# EAGLE design lcmeter (EAGLE 7.6.0)
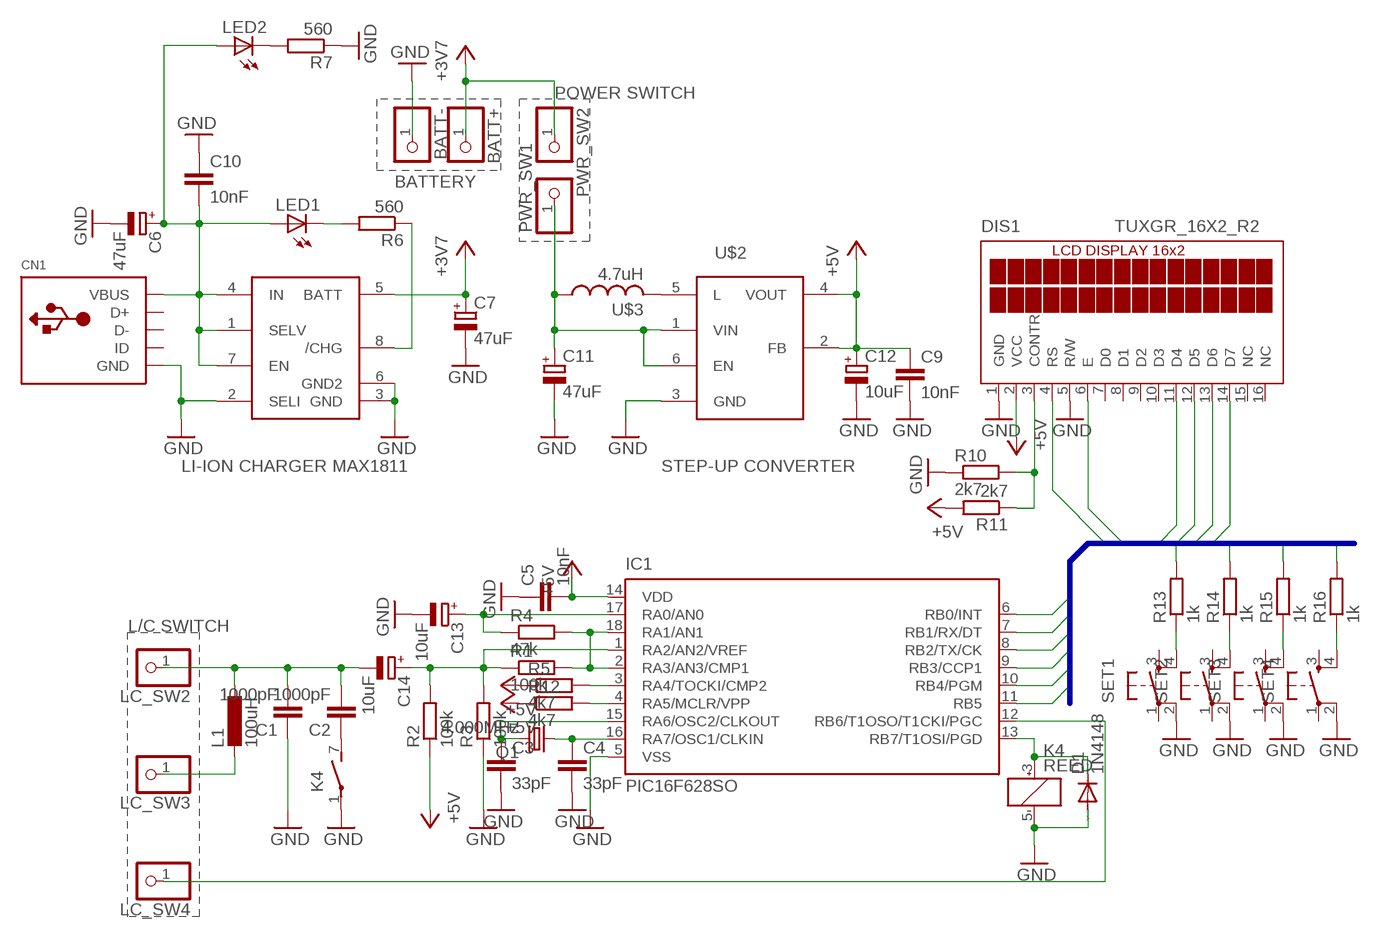
[diagram p0: schematic, sheet 1]

## Parts
BATT+  PINHD-1X1  [1X01]
BATT-  PINHD-1X1  [1X01]
C1  1000pF  C-EUC0805  [C0805]
C2  1000pF  C-EUC0805  [C0805]
C3  33pF  C-EUC0805  [C0805]
C4  33pF  C-EUC0805  [C0805]
C5  10nF  C-EUC0805  [C0805]
C6  47uF  CPOL-EUB/3528-21W  [B/3528-21W]
C7  47uF  CPOL-EUB/3528-21W  [B/3528-21W]
C9  10nF  C-EUC0805  [C0805]
C10  10nF  C-EUC0805  [C0805]
C11  47uF  CPOL-EUB/3528-21W  [B/3528-21W]
C12  10uF  CPOL-EUB/3528-21W  [B/3528-21W]
C13  10uF  CPOL-EUB/3528-21W  [B/3528-21W]
C14  10uF  CPOL-EUB/3528-21W  [B/3528-21W]
CN1  USBMINIB  [USB-MINIB]
D1  1N4148  DIODE-MINIMELF  [MINIMELF]
DIS1  TUXGR_16X2_R2  [TUXGR_16X2_R2]
IC1  PIC16F628SO  [SO-18W]
K4  REED  [REED]
L1  100uH  L-EU0204/5  [0204/5]
LC_SW2  PINHD-1X1  [1X01]
LC_SW3  PINHD-1X1  [1X01]
LC_SW4  PINHD-1X1  [1X01]
LED1  LED1206  [LED-1206]
LED2  LED1206  [LED-1206]
PWR_SW1  PINHD-1X1  [1X01]
PWR_SW2  PINHD-1X1  [1X01]
Q1  4.000MHz  CRYSTAL_CRYTALSM49  [CRYSTAL_SM49]
R1  100k  R-EU_R0603  [R0603]
R2  100k  R-EU_R0603  [R0603]
R3  100k  R-EU_R0603  [R0603]
R4  47k  R-EU_R0603  [R0603]
R5  4k7  R-EU_R0603  [R0603]
R6  560  R-EU_R0603  [R0603]
R7  560  R-EU_R0603  [R0603]
R10  2k7  R-EU_R0603  [R0603]
R11  2k7  R-EU_R0603  [R0603]
R12  4k7  R-EU_R0603  [R0603]
R13  1k  R-EU_R0603  [R0603]
R14  1k  R-EU_R0603  [R0603]
R15  1k  R-EU_R0603  [R0603]
R16  1k  R-EU_R0603  [R0603]
SET1  TAC_SWITCHPTH  [TACTILE-PTH]
SET2  TAC_SWITCHPTH  [TACTILE-PTH]
SET3  TAC_SWITCHPTH  [TACTILE-PTH]
SET4  TAC_SWITCHPTH  [TACTILE-PTH]
U$1  MAX1811SO8  [SO08]
U$2  TPS6122XSOT-6  [SOT23-6]
U$3  4.7uH  EPL3015-OK  [EPL3015]

## Nets
+3V3: BATT+.1 C7.+ PWR_SW2.1 U$1.5(BATT) ; supply symbol labelled +3V7
+5V: C5.2 C9.1 C12.+ DIS1.2(VCC) IC1.14(VDD) R2.1 R5.1 R11.2 R12.1 U$2.2(FB) U$2.4(VOUT)
GND: BATT-.1 C1.1 C3.2 C4.2 C5.1 C6.- C7.- C9.2 C10.1 C11.- C12.- C13.- CN1.GND D1.A DIS1.1(GND) DIS1.5(R/W) IC1.5(VSS) K4.1(2:P) K4.5(1:-) R3.1 R7.1 R10.1 SET1.2 SET2.2 SET3.2 SET4.2 U$1.2(SELI) U$1.3(GND) U$1.6(GND2) U$2.3(GND)
LCDPIN0: DIS1.4(RS) IC1.6(RB0/INT)
LCDPIN1: DIS1.6(E) IC1.7(RB1/RX/DT)
LCDPIN2: DIS1.11(D4) IC1.8(RB2/TX/CK) R13.2
LCDPIN3: DIS1.12(D5) IC1.9(RB3/CCP1) R14.2
LCDPIN4: DIS1.13(D6) IC1.11(RB5) R15.2
LCDPIN5: DIS1.14(D7) IC1.10(RB4/PGM) R16.2
N$1: C13.+ IC1.17(RA0/AN0) R4.1
N$2: IC1.2(RA3/AN3/CMP1) IC1.18(RA1/AN1) R1.2 R4.2
N$3: C14.+ IC1.1(RA2/AN2/VREF) R1.1 R2.2 R3.2
N$4: C1.2 C2.2 C14.- L1.1 LC_SW2.1
N$5: DIS1.3(CONTR) R10.2 R11.1
N$6: C2.1 K4.7(2:S)
N$7: IC1.3(RA4/TOCKI/CMP2) R5.2
N$8: IC1.12(RB6/T1OSO/T1CKI/PGC) LC_SW4.1
N$9: C4.1 IC1.16(RA7/OSC1/CLKIN) Q1.1
N$10: C3.1 IC1.15(RA6/OSC2/CLKOUT) Q1.2
N$11: D1.C IC1.13(RB7/T1OSI/PGD) K4.3(1:+)
N$12: R13.1 SET1.4
N$13: R14.1 SET2.4
N$14: R15.1 SET3.4
N$15: R16.1 SET4.4
N$16: IC1.4(RA5/MCLR/VPP) R12.2
N$17: L1.2 LC_SW3.1
N$18: C6.+ C10.2 CN1.VBUS LED1.A LED2.A U$1.1(SELV) U$1.4(IN) U$1.7(EN)
N$19: U$2.5(L) U$3.P$2
N$20: LED1.C R6.2
N$21: R6.1 U$1.8(/CHG)
N$23: C11.+ PWR_SW1.1 U$2.1(VIN) U$2.6(EN) U$3.P$1
N$24: LED2.C R7.2
Unconnected: CN1.D+ CN1.D- CN1.ID DIS1.7(D0) DIS1.8(D1) DIS1.9(D2) DIS1.10(D3) DIS1.15(NC) DIS1.16(NC) SET1.1 SET1.3 SET2.1 SET2.3 SET3.1 SET3.3 SET4.1 SET4.3

## Buses
LCDPIN[0..5]

## Notes on the sheet
- POWER SWITCH
- BATTERY
- LI-ION CHARGER MAX1811 | STEP-UP CONVERTER
- L/C SWITCH

## Library data of the parts
BATT+ BATT- LC_SW2-LC_SW4 PWR_SW1 PWR_SW2 = adafruit:PINHD-1X1: Pin header 1x1 for 0.1" spacing With round pins
C1-C5 C9 C10 = rcl:C-EU: CAPACITOR, European symbol
C6 C7 C11-C14 = rcl:CPOL-EU: POLARIZED CAPACITOR, European symbol
CN1 = adafruit:USB: USB Connectors USBMINIB - Surface Mount Female Mini-B USB Connector 4UConnector: 06564 By microbuilder.eu Thru-hole RA Female Mini-B USB Connector 4UConnector: 18732 By ladyada.net
D1 = diode:DIODE-: DIODE
DIS1 = display-lcd:TUXGR_16X2_R2: Tuxgraphics LCD display 16x2 characters reflective, without background light Source: tuxgr_12x2_r2.pdf; OC_FARNELL: unknown; OC_NEWARK: unknown
IC1 = microchip:PIC16F62*: FLASH-Based 8-Bit CMOS Microcontroller Source: http://ww1.microchip.com/downloads/en/DeviceDoc/40300C.pdf; MF: MICROCHIP; MPN: PIC16F628-20I/SO; OC_FARNELL: 9760415; OC_NEWARK: 23C4986
K4 = relay:REED: RELAY reed, 1 x norm. open with polarity, grid 5.08; OC_FARNELL: unknown; OC_NEWARK: unknown
L1 = rcl:L-EU: INDUCTOR, European symbol
LED1 LED2 = SparkFun:LED: LEDs Standard schematic elements and footprints for 5mm, 3mm, 1206, and 0603 sized LEDs. 5mm - Spark Fun Electronics SKU : COM-00529 (and others)
Q1 = icetubes:CRYSTAL_CRYTAL: CRYSTAL
R1-R7 R10-R16 = rcl:R-EU_: RESISTOR, European symbol
SET1-SET4 = SparkFun:TAC_SWITCH: Momentary Switch Button commonly used for reset or general input. Spark Fun Electronics SKU : COM-00097
U$1 = adafruit:MAX1811: Maxim MAX1811 USB li-ion battery charger http://www.ladyada.net/library/eagle
U$2 = trax_540:TPS6122X: Texas Instruments TPS6122x Low Input Voltage Step-up Converter Reference: http://focus.ti.com/docs/prod/folders/print/tps61220.html
U$3 = trax_540:EPL3015

## Board
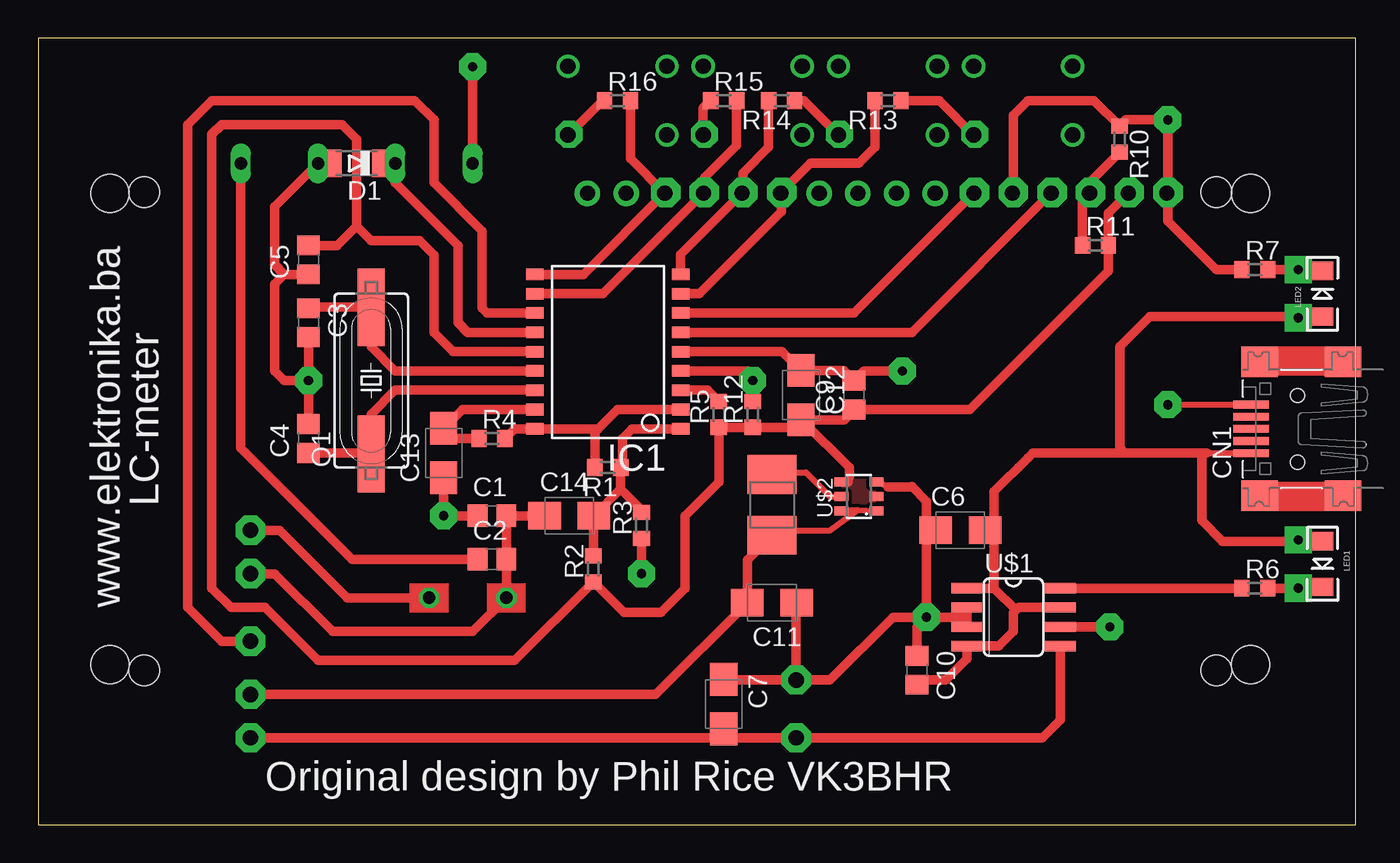
[diagram p1: board, top side]
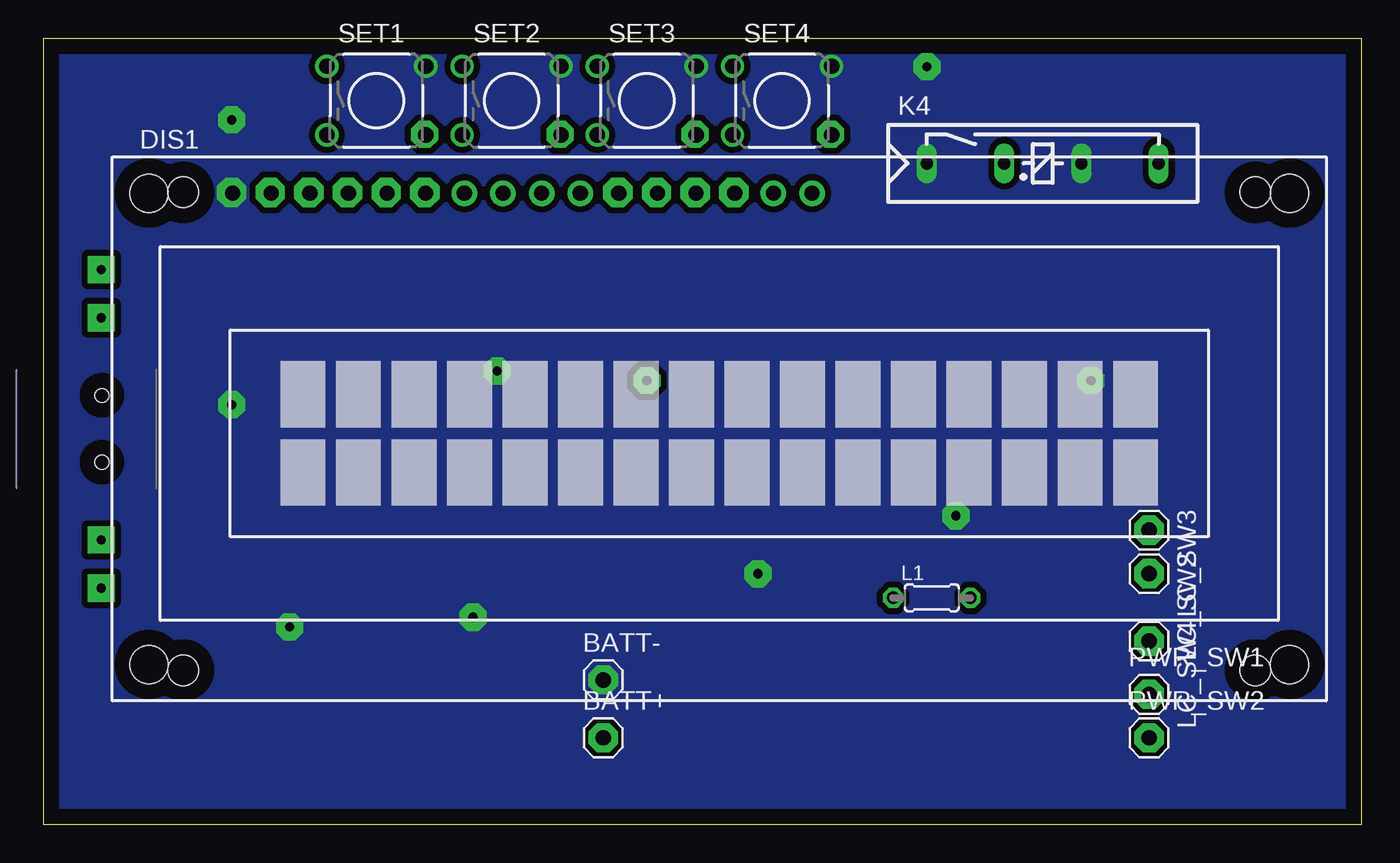
[diagram p2: board, bottom side, seen from below]

Size 86.66 x 51.74 mm. Coordinates in mm from the lower left corner, seen from the top.
Outline: 0,0 86.66,0 86.66,51.74 0,51.74 0,0
Copper layers (1*16): Top 0.035mm / dielectric 1.5mm / Bottom 0.035mm
Design rules "default": minimum track width 10mil, minimum drill 24mil, track to track 8mil, track to pad 8mil, pad to pad 8mil, via to via 8mil, smd to smd 8mil, copper to edge 40mil, drill to drill 8mil, minimum pad ring 10mil, minimum via ring 8mil, stop-mask expansion 4mil, vias tented up to drill 0mil, thermal gap 10mil
Holes 2 mm at 6.99,41.59 6.99,10.16 77.47,41.59 77.47,10.16

### Footprints (pad centres in the part's own frame; a part is rotated, then mirrored left to right if it is on the bottom)
1X01 = drill 1.016 pad 1.93 octagon: 1 0,0
C0805 = smd 1.3 x 1.5: 1 -0.95,0; 2 0.95,0
B/3528-21W = smd 2.15 x 1.8: + 1.625,0; - -1.625,0
USB-MINIB = smd 0.5 x 2.308: D+ 0,4.064; D- -0.8,4.064; GND 1.6,4.064; ID 0.8,4.064; VBUS -1.6,4.064 | smd 2 x 2.4: GND1 -4.4,-2; GND2 -4.4,3.5; GND3 4.4,3.5; GND4 4.4,-2 | hole 0.9: -2.2,1; 2.2,1
MINIMELF = smd 1.4 x 1.8: A 1.7,0; C -1.7,0
TUXGR_16X2_R2 = drill 1 pad 1.676: 1 -32,15.5; 2 -29.46,15.5; 3 -26.92,15.5; 4 -24.38,15.5; 5 -21.84,15.5; 6 -19.3,15.5; 7 -16.76,15.5; 8 -14.22,15.5; 9 -11.68,15.5; 10 -9.14,15.5; 11 -6.6,15.5; 12 -4.06,15.5; 13 -1.52,15.5; 14 1.02,15.5; 15 3.56,15.5; 16 6.1,15.5 | hole 2.5: -37.5,-15.5; 37.5,-15.5; -37.5,15.5; 37.5,15.5
SO-18W = smd 0.762 x 1.143: 1 -5.08,-4.788; 2 -3.81,-4.788; 3 -2.54,-4.788; 4 -1.27,-4.788; 5 0,-4.788; 6 1.27,-4.788; 7 2.54,-4.788; 8 3.81,-4.788; 9 5.08,-4.788; 10 5.08,4.788; 11 3.81,4.788; 12 2.54,4.788; 13 1.27,4.788; 14 0,4.788; 15 -1.27,4.788; 16 -2.54,4.788; 17 -3.81,4.788; 18 -5.08,4.788
REED = drill 0.813 long: 1 -17.78,2.54; 3 -12.7,2.54; 5 -7.62,2.54; 7 -2.54,2.54
0204/5 = drill 0.813 octagon: 1 -2.54,0; 2 2.54,0
LED-1206 = smd 1.2 x 1.4: A -1.5,0; C 1.5,0
CRYSTAL_SM49 = smd 5.08 x 1.778: 1 -4.826,0; 2 4.826,0
R0603 = smd 1 x 1.1: 1 -0.85,0; 2 0.85,0
TACTILE-PTH = drill 1.016: 1 -3.251,2.261; 2 3.251,2.261; 3 -3.251,-2.261; 4 3.251,-2.261
SO08 = smd 0.66 x 2.032: 1 -1.905,-3.073; 2 -0.635,-3.073; 3 0.635,-3.073; 4 1.905,-3.073; 5 1.905,3.073; 6 0.635,3.073; 7 -0.635,3.073; 8 -1.905,3.073
SOT23-6 = smd 0.6 x 0.9: 1 -0.95,-1.15; 2 0,-1.15; 3 0.95,-1.15; 4 0.95,1.15; 5 0,1.15; 6 -0.95,1.15
EPL3015 = smd 2.54 x 3.2: P$1 -0.953,0; P$2 3.035,0

### Placement (x,y rotation side)
BATT+  49.85,5.71 0 bottom
BATT-  49.85,9.53 0 bottom
C1  29.84,20.32 0 top
C2  29.84,17.46 0 top
C3  17.78,33.02 270 top
C4  17.78,25.4 90 top
C5  17.78,37.15 90 top
C6  60.64,19.37 0 top
C7  45.09,7.94 270 top
C9  53.66,28.26 90 top
C10  57.78,10.16 270 top
C11  48.26,14.61 180 top
C12  50.16,28.26 270 top
C13  26.67,24.45 90 top
C14  34.92,20.32 0 top
CN1  83.82,26.04 90 top
D1  20.95,43.5 180 top
DIS1  42.23,26.04 0 bottom
IC1  37.47,31.11 90 top
K4  10.79,40.96 0 bottom
L1  28.26,14.92 0 bottom
LC_SW2  13.97,16.51 270 bottom
LC_SW3  13.97,19.37 270 bottom
LC_SW4  13.97,12.06 270 bottom
LED1  84.45,17.14 270 top
LED2  84.45,34.92 90 top
PWR_SW1  13.97,8.57 0 bottom
PWR_SW2  13.97,5.71 0 bottom
Q1  21.91,29.21 90 top
R1  37.47,23.5 180 top
R2  36.51,16.83 90 top
R3  39.69,19.68 90 top
R4  29.84,25.4 0 top
R5  44.77,26.99 90 top
R6  80.01,15.56 0 top
R7  80.01,36.51 0 top
R10  71.12,45.09 270 top
R11  69.53,38.1 0 top
R12  46.99,26.99 90 top
R13  55.88,47.62 180 top
R14  48.9,47.62 180 top
R15  45.09,47.62 0 top
R16  38.1,47.62 0 top
SET1  64.77,47.62 0 bottom
SET2  55.88,47.62 0 bottom
SET3  46.99,47.62 0 bottom
SET4  38.1,47.62 0 bottom
U$1  64.14,13.65 270 top
U$2  53.98,21.59 90 top
U$3  48.26,20 90 top

### Tracks (layer width: path | path; a pad name or v marks a point on that pad's centre or on a via)
+3V3
  Top 0.61: PWR_SW2.1 45.09,5.71 | 45.09,5.71 BATT+.1 66.04,5.71 67.21,6.88 U$1.5 | 45.09,5.71 C7.+
+5V
  Top 0.406: 53.34,22.86 53.34,22.45 U$2.4
  Top 0.61: IC1.14 27.3,31.11 26.04,32.38 26.04,37.47 25.08,38.42 21.91,38.42 20.95,39.37 | 20.95,39.37 20.95,45.09 20,46.04 12.06,46.04 11.43,45.4 11.43,15.56 12.7,14.29 14.92,14.29 18.41,10.79 31.33,10.79 R2.1 38.52,13.97 40.96,13.97 42.55,15.56 42.55,20.32 44.77,22.54 R5.1 R12.1 49.67,26.14 C12.+ | 20.95,39.37 19.68,38.1 C5.2 | C12.+ 50.2,26.63 53.34,23.5 53.34,22.86 | C12.+ 52.98,26.63 C9.1 61.28,27.3 70.38,36.41 R11.2 70.38,40.23 DIS1.2
  pour Top (isolate 0.229, no thermals): 53.02,22.54 53.02,21.27 54.93,21.27 54.93,22.54
GND  (via drill 0.6 pad 1.78, 0.6 pad 1.93)
  Top 0.406: CN1.GND 74.31,27.64 v74.3,27.62 | U$2.3 55.87,22.24 arc-90 55.88,22.23
  Top 0.61: v74.3,41.59 v74.3,46.35 71.54,46.35 R10.1 69.43,47.62 65.09,47.62 64.14,46.67 64.14,41.6 DIS1.5 | 61.06,13.65 U$1.3 | 61.06,13.65 U$1.2 | U$1.6 v70.48,13.02 | v58.42,13.65 61.06,13.65 | C10.1 57.78,13.02 v58.42,13.65 | C4.2 v17.78,29.21 | v17.78,29.21 C3.2 | D1.A K4.5 15.56,40.64 15.56,36.83 16.19,36.2 | C5.1 16.2,36.2 16.19,36.2 | 16.19,36.2 15.56,35.56 15.56,29.84 16.19,29.21 v17.78,29.21 | K4.1 v28.57,49.85 | C13.- v26.67,20.32 C1.1 | v39.69,16.51 R3.1 | IC1.5 48.93,31.11 C12.- 52.98,29.88 C9.2 54.3,29.84 v56.83,29.84 | C11.- 49.85,14.57 BATT-.1 | BATT-.1 52.07,9.53 56.2,13.65 v58.42,13.65 | v58.42,13.65 58.42,19.37 | 58.42,19.37 58.42,21.27 57.45,22.24 57.45,22.23 55.88,22.23 | R7.1 77.47,36.51 74.3,39.69 74.3,41.47 DIS1.1 | BATT-.1 45.12,9.53 C7.- | 58.42,19.37 C6.-
  pour Bottom (isolate 0.406, no thermals): -0.64,52.39 87.31,52.39 87.31,-0.64 -0.64,-0.64
LCDPIN0
  Top 0.61: IC1.6 57.46,32.38 DIS1.4
LCDPIN1
  Top 0.61: IC1.7 53.65,33.66 DIS1.6
LCDPIN2
  Top 0.61: R13.2 55.03,44.55 53.98,43.5 50.79,43.5 DIS1.11 48.9,41.47 48.9,40.32 43.5,34.92 IC1.8
LCDPIN3
  Top 0.61: R14.2 48.05,44.55 46.35,42.86 46.35,41.6 DIS1.12 42.25,37.5 IC1.9
LCDPIN4
  Top 0.61: R15.2 45.94,44.66 43.81,42.55 43.81,41.6 DIS1.13 37.14,34.92 IC1.11
LCDPIN5
  Top 0.61: R16.2 38.95,43.79 DIS1.14 35.87,36.2 IC1.10
N$1
  Top 0.61: IC1.17 27.9,27.3 C13.+ 27.34,25.4 R4.1
N$2
  Top 0.61: IC1.2 38.1,27.3 36.83,26.04 36.51,26.04 | 36.51,26.04 IC1.18 31.33,26.04 R4.2 | R1.2 36.62,25.93 36.51,26.04
N$3
  Top 0.61: IC1.1 39.05,26.04 38.42,25.4 38.42,23.6 R1.1 38.31,22.09 | 38.31,22.09 C14.+ 36.51,20.28 R2.2 | R3.2 39.69,20.71 38.31,22.09
N$4
  Top 0.61: 33.02,20.04 C14.- C1.2 C2.2 L1.1 28.57,12.7 19.37,12.7 15.56,16.51 LC_SW2.1
N$5
  Top 0.61: 68.58,38 R11.1 68.68,41.07 DIS1.3 69.15,42.26 R10.2
N$6
  Top 0.61: C2.1 20.64,17.46 13.34,24.77 K4.7
N$7
  Top 0.61: IC1.3 44.03,28.57 R5.2
N$8
  Top 0.61: IC1.12 29.53,33.66 29.21,33.97 29.21,39.05 26.04,42.23 26.04,46.35 24.77,47.62 11.43,47.62 9.84,46.04 9.84,14.29 12.06,12.06 LC_SW4.1
N$9
  Top 0.61: Q1.1 21.34,23.82 | IC1.16 23.5,28.57 21.91,26.99 Q1.1 | C4.1 21.84,24.45 Q1.1
N$10
  Top 0.61: IC1.15 23.5,29.84 21.91,31.43 Q1.2 17.85,34.04 C3.1
N$11
  Top 0.61: D1.C K4.3 23.5,42.23 27.62,38.1 27.62,33.02 28.26,32.38 IC1.13
N$12
  Top 0.61: R13.1 59.26,47.62 SET1.4
N$13
  Top 0.61: R14.1 50.37,47.62 SET2.4
N$14
  Top 0.61: R15.1 43.74,47.13 SET3.4
N$15
  Top 0.61: R16.1 37.11,47.62 SET4.4
N$16  (via drill 0.6 pad 1.78)
  Top 0.61: IC1.4 46.67,29.84 46.99,29.53 v46.99,29.21 R12.2
N$17
  Top 0.61: L1.2 20.32,14.92 15.88,19.37 LC_SW3.1
N$18
  Top 0.406: CN1.VBUS 79.43,24.45 76.83,24.45
  Top 0.61: 64.29,14.13 64.14,13.97 64.14,12.7 63.18,11.75 U$1.4 61.06,10.9 59.69,9.53 58.1,9.53 C10.2 | 64.29,14.13 64.45,14.29 U$1.7 | 62.87,15.56 U$1.1 | 64.29,14.13 62.87,15.56 | 71.44,24.45 65.41,24.45 65.09,24.13 | 71.44,24.45 76.52,24.45 | 76.52,24.45 76.83,24.45 | 65.09,24.13 64.45,23.5 | 62.87,15.56 62.87,19.37 | 62.87,19.37 62.87,21.91 65.09,24.13 | LED1.A 77.88,18.64 76.52,20 76.52,24.45 | LED2.A 73.11,33.42 71.12,31.43 71.12,24.77 71.44,24.45 | 62.87,19.37 C6.+
N$19
  Top 0.406: U$2.5 52.09,21.57 50.48,23.18 48.4,23.18 U$3.P$2
N$20  (via drill 0.6 pad 1.78)
  Top 0.61: R6.2 v82.87,15.56 84.37,15.56 LED1.C
N$21
  Top 0.61: U$1.8 R6.1
N$22  (via drill 0.6 pad 1.78)
  other vias: 34.92,45.4
N$23
  Top 0.406: 53.91,20.69 U$2.6 | 53.91,20.69 U$2.1 | U$3.P$1 48.58,19.37 52.09,19.37 53.91,20.69
  Top 0.61: U$3.P$1 46.63,17.43 C11.+ 40.6,8.57 PWR_SW1.1
N$24  (via drill 0.6 pad 1.78)
  Top 0.61: R7.2 v82.87,36.51 84.37,36.51 LED2.C
N$25  (via drill 0.6 pad 1.78)
  other vias: 43.81,45.4
N$26  (via drill 0.6 pad 1.78)
  other vias: 52.7,45.4
N$27  (via drill 0.6 pad 1.78)
  other vias: 61.59,45.4
N$28  (via drill 0.6 pad 1.93)
  other vias: 41.27,41.59
N$29  (via drill 0.6 pad 1.93)
  other vias: 43.81,41.59
N$30  (via drill 0.6 pad 1.93)
  other vias: 46.35,41.59
N$31  (via drill 0.6 pad 1.93)
  other vias: 48.9,41.59
N$32  (via drill 0.6 pad 1.93)
  other vias: 61.59,41.59
N$33  (via drill 0.6 pad 1.93)
  other vias: 64.14,41.59
N$34  (via drill 0.6 pad 1.93)
  other vias: 66.67,41.59
N$35  (via drill 0.6 pad 1.93)
  other vias: 69.22,41.59
N$36  (via drill 0.6 pad 1.93)
  other vias: 71.75,41.59
N$37  (via drill 0.6 pad 1.78)
  other vias: 82.87,33.34
N$38  (via drill 0.6 pad 1.78)
  other vias: 82.87,18.73
(copper drawn outside any net)
  shapes: Top area x4

### Text on the board
_tsilk: LC-meter | www.elektronika.ba | Original design by Phil Rice VK3BHR